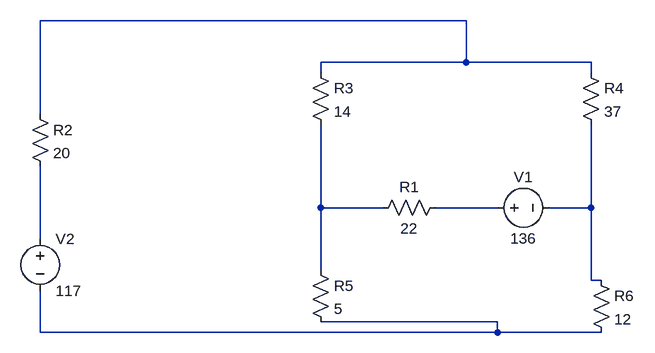
[diagram p0: schematic Draft3.asc]
Draft3.asc, the LTspice schematic file:
Version 4.1
SHEET 1 1064 680
WIRE 800 -48 144 -48
WIRE 800 16 800 -48
WIRE 800 16 576 16
WIRE 992 16 800 16
WIRE 576 32 576 16
WIRE 992 32 992 16
WIRE 144 96 144 -48
WIRE 576 240 576 112
WIRE 672 240 576 240
WIRE 848 240 752 240
WIRE 992 240 992 112
WIRE 992 240 928 240
WIRE 144 288 144 176
WIRE 576 336 576 240
WIRE 992 352 992 240
WIRE 1008 352 992 352
WIRE 848 416 576 416
WIRE 144 432 144 368
WIRE 848 432 848 416
WIRE 848 432 144 432
WIRE 1008 432 848 432
SYMBOL res 128 80 R0
SYMATTR InstName R2
SYMATTR Value 20
SYMBOL voltage 144 272 R0
SYMATTR InstName V2
SYMATTR Value 117
SYMBOL res 560 16 R0
SYMATTR InstName R3
SYMATTR Value 14
SYMBOL res 976 16 R0
SYMATTR InstName R4
SYMATTR Value 37
SYMBOL res 560 320 R0
SYMATTR InstName R5
SYMATTR Value 5
SYMBOL res 992 336 R0
SYMATTR InstName R6
SYMATTR Value 12
SYMBOL res 768 224 R90
WINDOW 0 0 56 VBottom 2
WINDOW 3 32 56 VTop 2
SYMATTR InstName R1
SYMATTR Value 22
SYMBOL voltage 832 240 R270
WINDOW 0 32 56 VTop 2
WINDOW 3 -32 56 VBottom 2
SYMATTR InstName V1
SYMATTR Value 136

The netlist it stands for:
* Draft3.asc
R2 N001 N005 20
V2 N005 N006 117
R3 N001 N002 14
R4 N001 N004 37
R5 N002 N006 5
R6 N004 N006 12
R1 N003 N002 22
V1 N003 N004 136
.backanno
.end